# EAGLE design TIRA LEDS RGB (EAGLE 9.5.2)
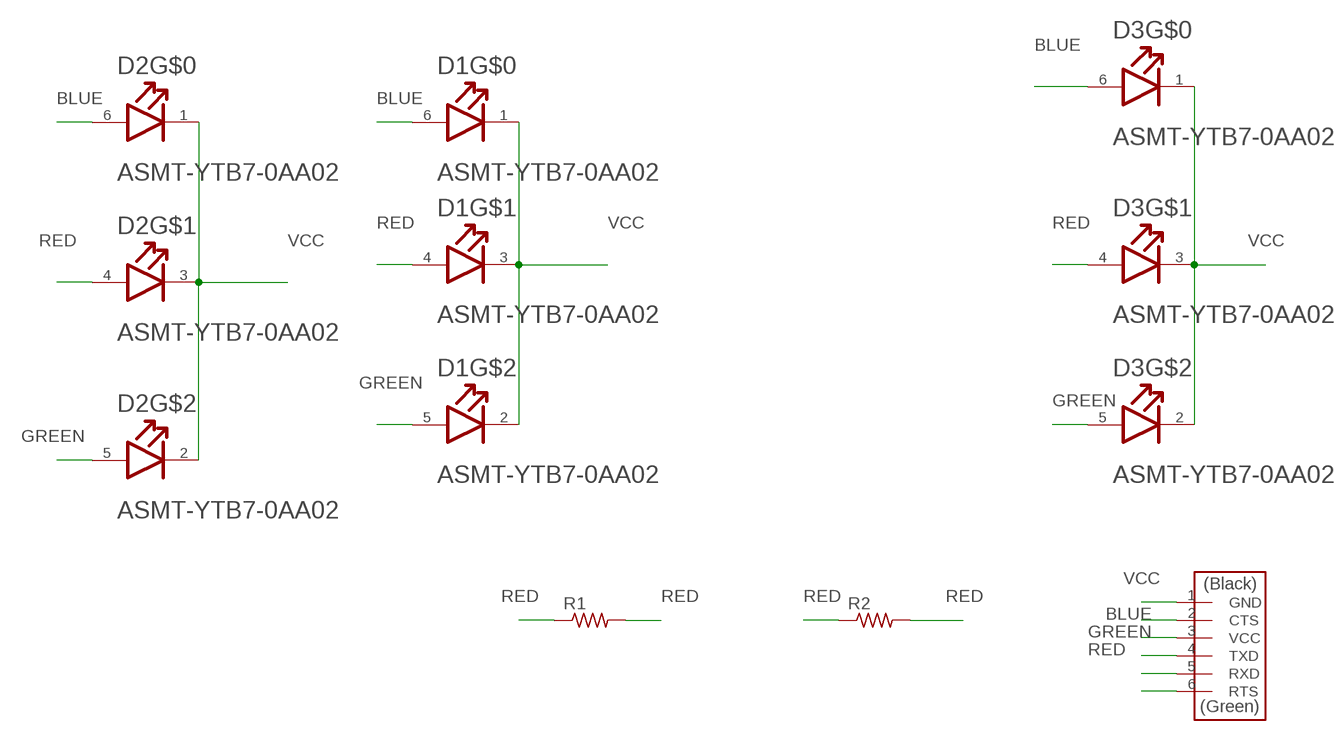
[diagram p0: schematic, sheet 1]

## Parts
D1  BROADCOM_ASMT-YTB7-0AA02BROADCOM_ASMT-YTB7-0AA02_0_0  [BROADCOM_ASMT-YTB7-0AA02_0]
D2  BROADCOM_ASMT-YTB7-0AA02BROADCOM_ASMT-YTB7-0AA02_0_0  [BROADCOM_ASMT-YTB7-0AA02_0]
D3  BROADCOM_ASMT-YTB7-0AA02BROADCOM_ASMT-YTB7-0AA02_0_0  [BROADCOM_ASMT-YTB7-0AA02_0]
R1  R1206FAB  [R1206FAB]
R2  R1206FAB  [R1206FAB]
U$1  CONN_06_FTDI-SMD-HEADER  [1X06SMD]

## Nets
BLUE: D1.6(ANODE(BLUE)) D2.6(ANODE(BLUE)) D3.6(ANODE(BLUE)) U$1.2(CTS)
GREEN: D1.5(ANODE(GREEN)) D2.5(ANODE(GREEN)) D3.5(ANODE(GREEN)) U$1.3(VCC)
N$5: U$1.5(RXD)
N$6: U$1.6(RTS)
RED: D1.4(ANODE(RED)) D2.4(ANODE(RED)) D3.4(ANODE(RED)) R1.1 R1.2 R2.1 R2.2 U$1.4(TXD)
VCC: D1.1(CATHODE(BLUE)) D1.2(CATHODE(GREEN)) D1.3(CATHODE(RED)) D2.1(CATHODE(BLUE)) D2.2(CATHODE(GREEN)) D2.3(CATHODE(RED)) D3.1(CATHODE(BLUE)) D3.2(CATHODE(GREEN)) D3.3(CATHODE(RED)) U$1.1(GND)

## Library data of the parts
D1-D3 = Broadcom - ASMT-YTB7-0AA02:BROADCOM_ASMT-YTB7-0AA02: Red, Green, Blue (RGB) 623nm Red, 529nm Green, 469nm Blue LED Indication - Discrete 2.1V Red, 3.1V Green, 3.1V Blue 6-SMD, J-Lead; AUTOMOTIVE: No; CENTROID_NOT_SPECIFIED: No; COLOUR: Blue, Green, Red; DATASHEET: https://docs.broadcom.com/doc/AV02-3793EN; DEVICE_CLASS_L1: Optoelectronics; DEVICE_CLASS_L2: LEDs; DEVICE_CLASS_L3: unset; DIGIKEY_DESCRIPTION: LED RGB DIFFUSED 6PLCC SMD; DIGIKEY_PART_NUMBER: 516-3132-1-ND; FOOTPRINT_VARIANT_NAME_0: Recommended_Land_Pattern; FORWARD_CURRENT: 20mA; FORWARD_VOLTAGE: 2.1/3.1/3.1V; HEIGHT: 2mm; LEAD_FREE: Yes; LED_ORIENTATION: Top View; LUMINOUS_INTENSITY: 650/1900/384mcd; MAX_JUNCTION_TEMP: +110°C; MF: Broadcom; MFG_PACKAGE_IDENT: PLCC-6; MFG_PACKAGE_IDENT_COMPONENT_ID: 4a2926bc4dc27d95; MFG_PACKAGE_IDENT_DATE: 0; MFG_PACKAGE_IDENT_REV: 0; MOUSER_DESCRIPTION: LED Tri-Color Blue/Green/Red 469nm/529nm/623nm Chip LED 6-Pin PLCC T/R; MOUSER_PART_NUMBER: 630-ASMT-YTB7-0AA02; MPN: ASMT-YTB7-0AA02; PACKAGE: PLCC6; PEAK_EMMISION_WAVELENGTH: 630/522/465nm; POWER_DISSIPATION: 125/90/90mW; PREFIX: D; REVERSE_VOLTAGE: 4V; ROHS: Yes; TEMPERATURE_RANGE_HIGH: +100°C; TEMPERATURE_RANGE_LOW: -40°C; VERIFICATION_VERSION: 0.0.0.3; VIEWING_ANGLE: 120°; WAVELENGTH: 623/529/469nm
R1 R2 = eagle_fab:R: Resistor (US Symbol) Variants with postfix FAB are widened to allow the routing of internal traces
U$1 = eagle_fab:CONN_06_FTDI-SMD-HEADER

## Board
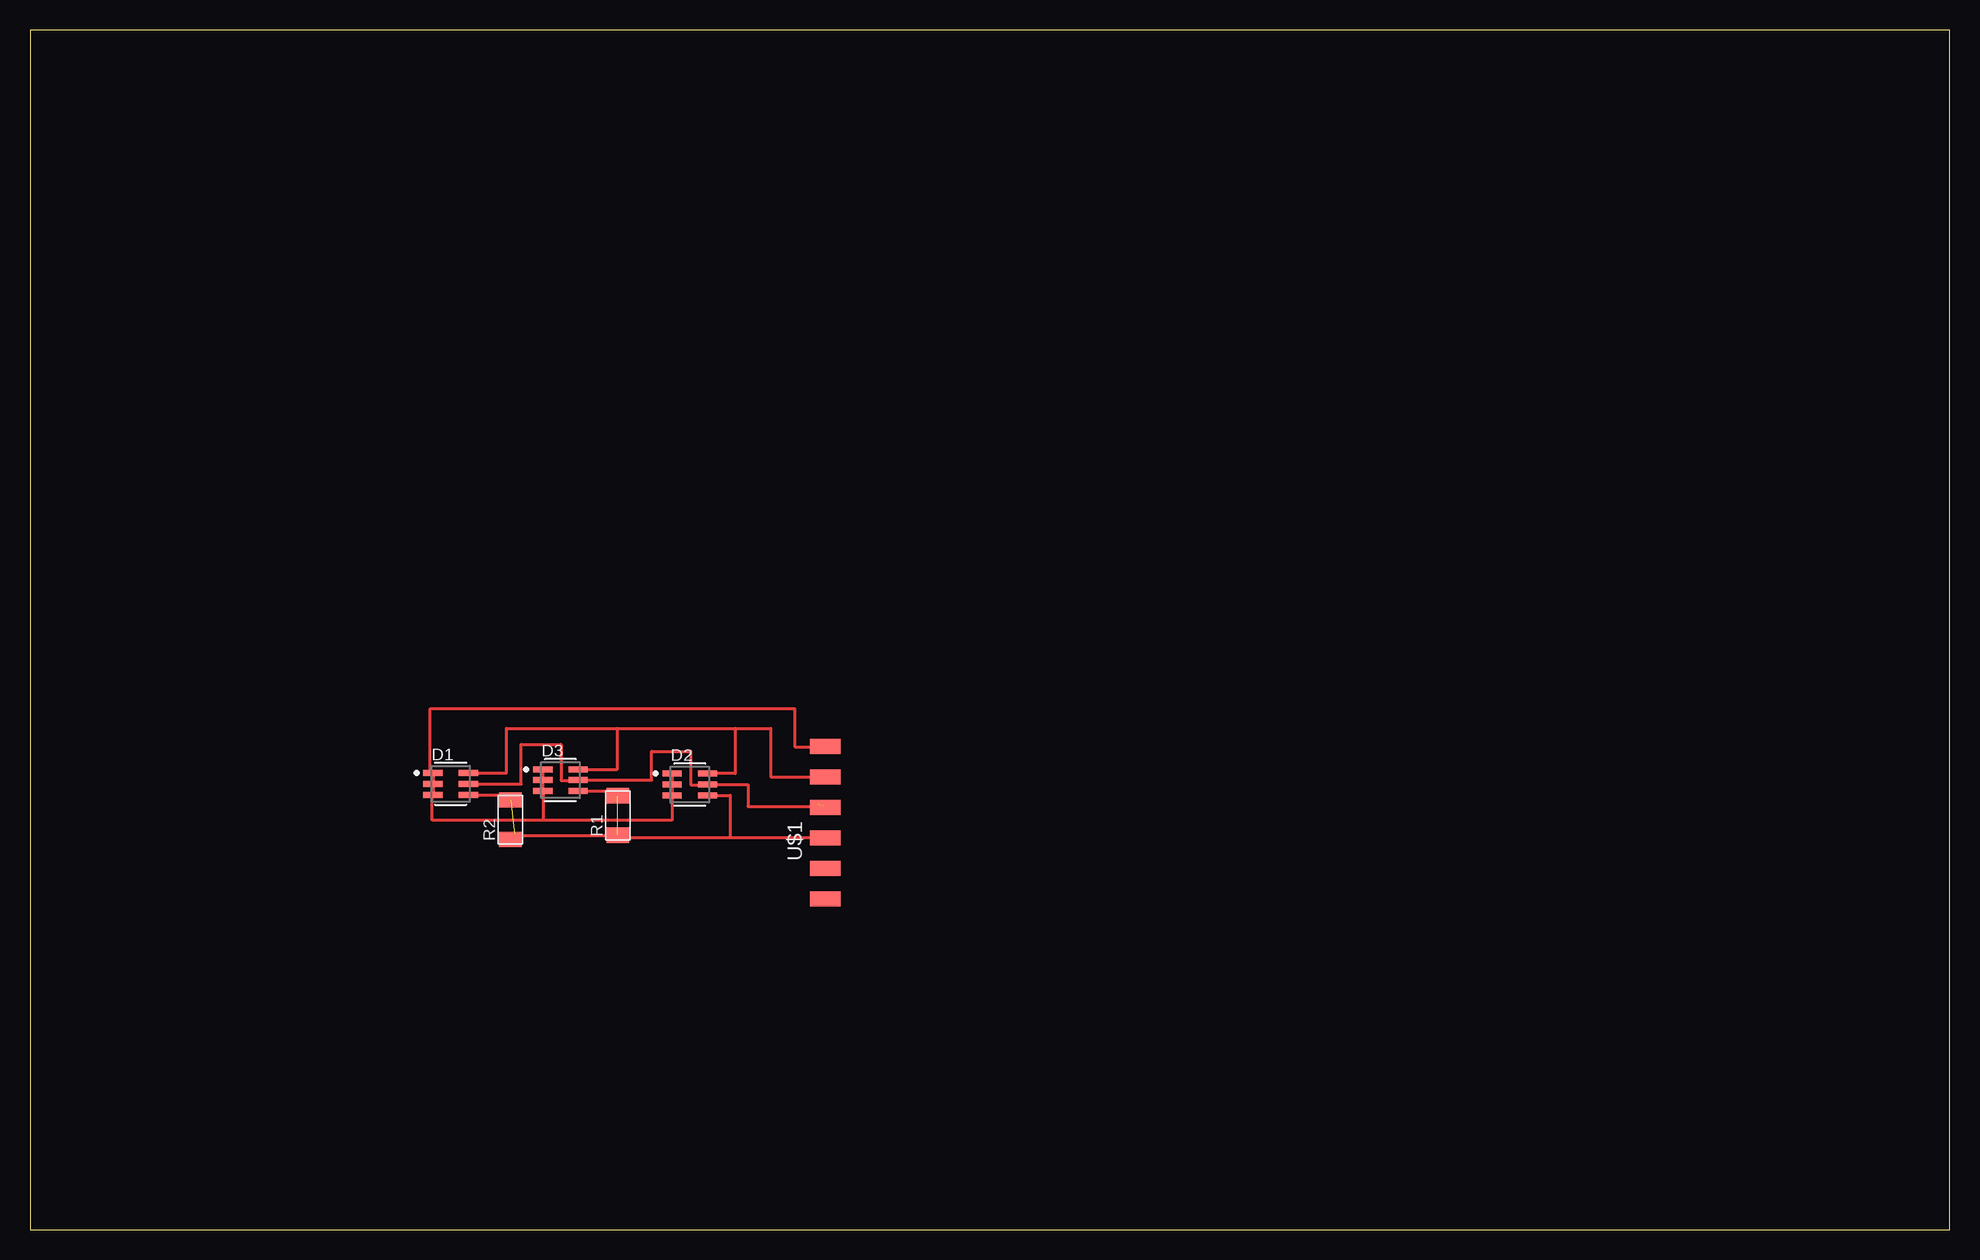
[diagram p1: board, top side]

Size 160 x 100 mm. Coordinates in mm from the lower left corner, seen from the top.
Outline: 0,0 160,0 160,100 0,100 0,0
Copper layers (1*16): Top 0.035mm / dielectric 1.5mm / Bottom 0.035mm
Design rules "eagle_fab": minimum track width 10mil, minimum drill 32mil, track to track 16mil, track to pad 16mil, pad to pad 16mil, via to via 16mil, smd to smd 6mil, copper to edge 16mil, drill to drill 16mil, minimum pad ring 10mil, minimum via ring 8mil, stop-mask expansion 4mil, vias tented up to drill 0mil, thermal gap 16mil

### Footprints (pad centres in the part's own frame; a part is rotated, then mirrored left to right if it is on the bottom)
BROADCOM_ASMT-YTB7-0AA02_0 = smd 1.6 x 0.5: 1 -1.475,0.9; 2 -1.475,0; 3 -1.475,-0.9; 4 1.475,-0.9; 5 1.475,0; 6 1.475,0.9
R1206FAB = smd 1.27 x 1.905: 1 -1.651,0; 2 1.651,0
1X06SMD = smd 2.54 x 1.27: 1 0,6.35; 2 0,3.81; 3 0,1.27; 4 0,-1.27; 5 0,-3.81; 6 0,-6.35

### Placement (x,y rotation side)
D1  35.06,37.15 0 top
D2  54.99,37.1 0 top
D3  44.22,37.47 0 top
R1  49,34.52 90 top
R2  40.04,34.17 90 top
U$1  66.28,33.92 0 top

### Tracks (layer width: path | path; a pad name or v marks a point on that pad's centre or on a via)
BLUE
  Top 0.254: D3.6 48.94,38.37 48.94,41.77 | 56.45,38.02 D2.6 58.77,38 58.77,41.77 | D1.6 39.72,38.05 39.72,41.77 48.94,41.77 | 48.94,41.77 58.77,41.77 | 58.77,41.77 61.74,41.77 61.74,37.73 U$1.2
GREEN  (1 unrouted)
  Top 0.254: D3.5 45.29,37.47 | U$1.3 66.15,35.32 | D1.5 40.92,37.15 40.95,37.15 40.95,40.44 44.27,40.44 44.27,37.45 45.7,37.45 D3.5 | D3.5 51.83,37.47 51.83,39.87 55.08,39.87 55.08,37.06 56.47,37.06 D2.5 59.84,37.1 59.84,35.29 65.74,35.29 65.74,35.5
RED  (2 unrouted)
  Top 0.254: 40.04,32.61 R2.1 | R2.1 40.26,32.74 | 66.04,32.41 U$1.4 58.36,32.65 | R2.1 | D1.4 40.04,36.25 R2.2 | R2.1 40.42,32.89 | D3.4 49.45,36.57 49.45,36.17 R1.2 | 56.5,36.2 D2.4 58.36,36.2 58.36,32.65 | R2.1 40.04,32.87 R1.1 49,32.65 58.36,32.65
VCC
  Top 0.254: D1.1 D1.2 D1.3 33.53,36.25 33.53,34.12 42.76,34.12 | D3.1 D3.2 D3.3 42.76,34.12 | D1.1 | 53.49,38 D2.1 D2.2 D2.3 53.52,34.12 42.76,34.12 | D1.1 33.35,38.05 33.35,43.42 63.74,43.42 63.74,40.23 66.28,40.23 U$1.1